# Altium schematic sheet IR_LED.SchDoc: IR_LED
size A3; Date: 13/11/2025; DrawnBy: Văn Quý Tuân; Revision: 1; SheetNumber: 4; SheetTotal: 10; Size: A3; Subsystem: HW-11/11/25
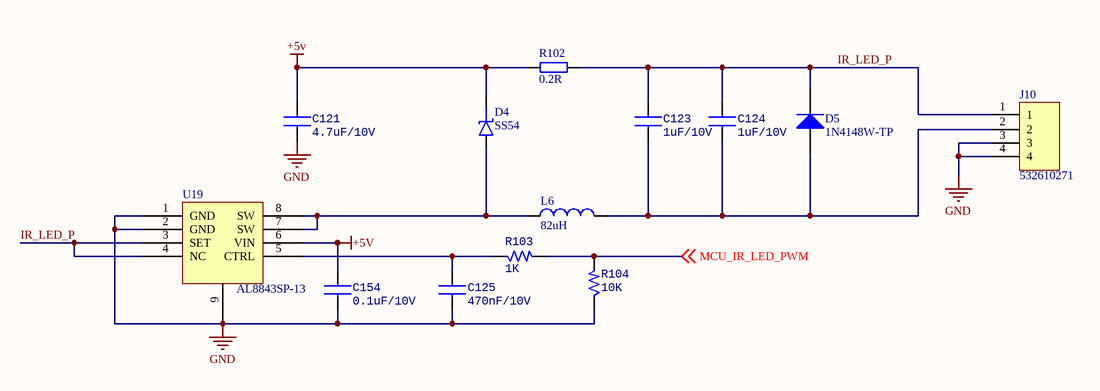
[diagram p0: IR_LED.SchDoc]

## Parts
C121  4.7uF/10V  [CAP-CER-0603]
C123  1uF/10V  [CAP-CER-0603]
C124  1uF/10V  [CAP-CER-0603]
C125  470nF/10V  [CAP-CER-0603]
C154  0.1uF/10V  [CAP-CER-0603]
D4  SS54  [DO-214AC-2 (SMA)]
D5  1N4148W-TP  [DIODE SOD-123]
J10  532610271  [CON4_653104131822_SMD]
L6  82uH  [INDUCTOR-SRR4828A-820M]
R102  0.2R  [RES_1206]
R103  1K  [RES-SMD-0603]
R104  10K  [RES-SMD-0603]
U19  AL8843SP-13  [AL8843SP-13]

## Nets
+5V: C121.1 C154.1 D4.K R102.1 U19.6(VIN)
GND: C121.2 C125.2 C154.2 J10.3 J10.4 R104.1 U19.1(GND) U19.2(GND) U19.9(EPAD)
IR_LED_P: C123.1 C124.1 D5.2(K) J10.1 R102.2 U19.3(SET) U19.4(NC)
MCU_IR_LED_PWM: R103.2 R104.2 ; off-sheet MCU_IR_LED_PWM
NetC123_2: C123.2 C124.2 D5.1(A) J10.2 L6.2
NetC125_1: C125.1 R103.1 U19.5(CTRL)
NetD4_A: D4.A L6.1 U19.7(SW) U19.8(SW)

## Notes on the sheet
- Project:
- Sub-system:
- Checked by:
- Design by:
- Sheet title:
- Doc no:
- Sheet
- Size
- Approved by:
- Revision:
- Date
- Text

## Library data of the parts
C121 C123-C125 C154 = CAP-CER
D4 = D_SCHOTTKY_SMA: Diode Schottky SMD SMA (DO-214AA)
D5 = Diode S4: Dán; Ten_Linh_Kien: Diode S4 SOD123 ( 1N5819 SOD123); Ma_Hang: MH005519; Don_Vi: Con; Ghi_Chu: *; Chung_Loai: Dán; Kieu_Chan: *
J10 = CON-PLG_4X1-50-RA-SMD: 4 Pins, 1 Row 1.25mm Pitch, right angle Connector, male; Manufacturer: WE; Manufacturer Part Number: 653104131822; Mating Part Number: 653004113322; Crimp Part Number: 65300113722DEC; Alternate Part Number-1: NA; Case/Package: TH-CON; Supplier-1: WURTH; Supplier Part Number-1: 653104131822
L6 = INDUCT-SMD: MP: LQM18PZ2R2MFHD; MF: Murata; Price: None; Package: 1608 Murata; Value: *; SnapEDA_Link: https://www.snapeda.com/parts/LQM18PZ2R2MFHD/Murata/view-part/1498702/?ref=snap; Availability: Good; Check_prices: https://www.snapeda.com/parts/LQM18PZ2R2MFHD/Murata/view-part/1498702/?ref=eda; Purchase-URL: https://pricing.snapeda.com/search/part/LQM18PZ2R2MFHD/?ref=eda
R102 = RES_1206: Resistor SMD 1206; Manufacturer: *; Manufacturer Part Number: *; Distributor Link: *; LCSC: *
R103 R104 = RES-SMD